# EAGLE schematic LE1-1 (EAGLE 8.5.1)
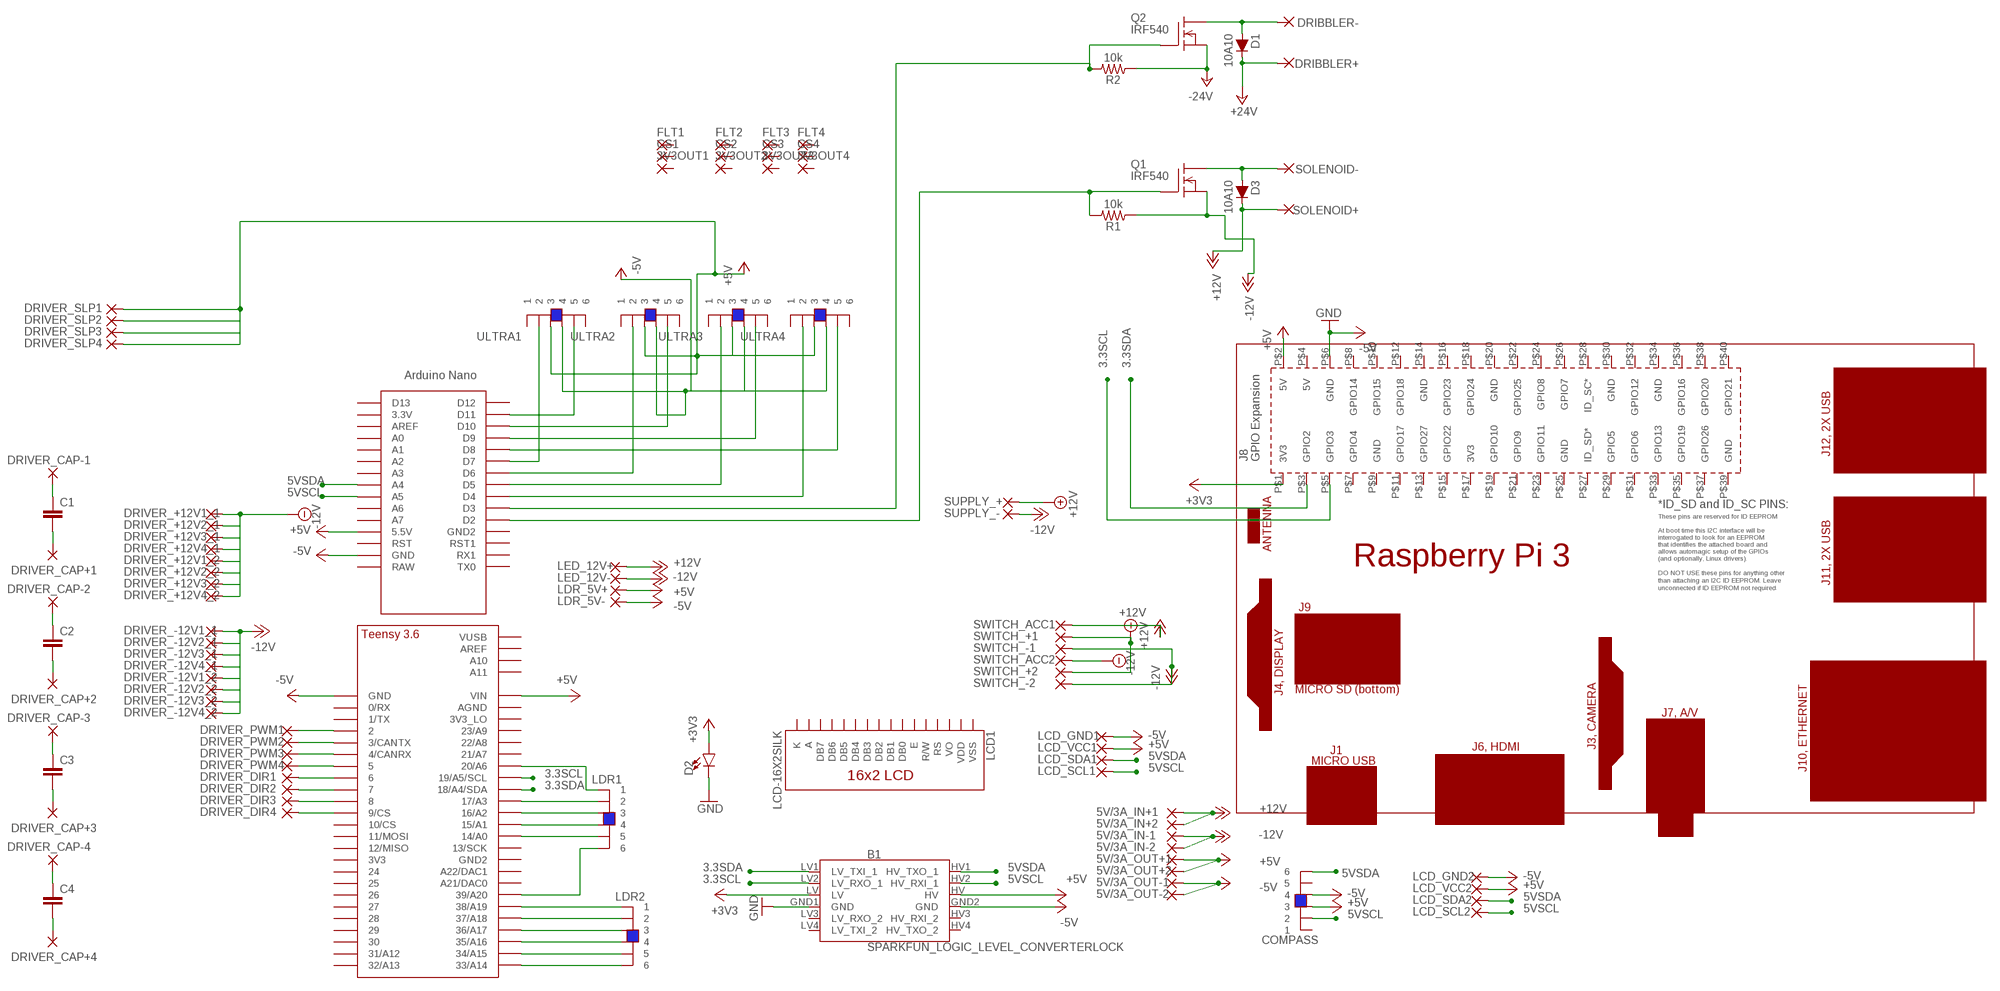
[diagram p0: schematic, sheet 1]

## Parts
3V3OUT1  2,54/1,0  [2,54/1,0]
3V3OUT2  2,54/1,0  [2,54/1,0]
3V3OUT3  2,54/1,0  [2,54/1,0]
3V3OUT4  2,54/1,0  [2,54/1,0]
5V/3A_IN+1  WIREPAD2,54/1,0  [2,54/1,0]
5V/3A_IN+2  WIREPAD2,54/1,0  [2,54/1,0]
5V/3A_IN-1  WIREPAD2,54/1,0  [2,54/1,0]
5V/3A_IN-2  WIREPAD2,54/1,0  [2,54/1,0]
5V/3A_OUT+1  WIREPAD2,54/1,0  [2,54/1,0]
5V/3A_OUT+2  WIREPAD2,54/1,0  [2,54/1,0]
5V/3A_OUT-1  WIREPAD2,54/1,0  [2,54/1,0]
5V/3A_OUT-2  WIREPAD2,54/1,0  [2,54/1,0]
B1  SPARKFUN_LOGIC_LEVEL_CONVERTERLOCK  [SPARKFUN_LOGIC_LEVEL_CONVERTER_LOCK]
C1  C5/7.2  [C5B7.2]
C2  C5/7.2  [C5B7.2]
C3  C5/7.2  [C5B7.2]
C4  C5/7.2  [C5B7.2]
COMPASS  6P6C_FEMALESMD  [6P6C_FEMALE]
CS1  2,54/1,0  [2,54/1,0]
CS2  2,54/1,0  [2,54/1,0]
CS3  2,54/1,0  [2,54/1,0]
CS4  2,54/1,0  [2,54/1,0]
D1  10A10  DIODE-1N4148  [DIODE-1N4148]
D2  LED-3MM-NO_SILK  [LED_3MM-NS]
D3  10A10  DIODE-1N4148  [DIODE-1N4148]
DRIBBLER+  2,54/1,0  [2,54/1,0]
DRIBBLER-  2,54/1,0  [2,54/1,0]
DRIVER_+12V1_1  WIREPAD2,54/1,0  [2,54/1,0]
DRIVER_+12V1_2  WIREPAD2,54/1,0  [2,54/1,0]
DRIVER_+12V2_1  WIREPAD2,54/1,0  [2,54/1,0]
DRIVER_+12V2_2  WIREPAD2,54/1,0  [2,54/1,0]
DRIVER_+12V3_1  WIREPAD2,54/1,0  [2,54/1,0]
DRIVER_+12V3_2  WIREPAD2,54/1,0  [2,54/1,0]
DRIVER_+12V4_1  WIREPAD2,54/1,0  [2,54/1,0]
DRIVER_+12V4_2  WIREPAD2,54/1,0  [2,54/1,0]
DRIVER_-12V1_1  WIREPAD2,54/1,0  [2,54/1,0]
DRIVER_-12V1_2  WIREPAD2,54/1,0  [2,54/1,0]
DRIVER_-12V2_1  WIREPAD2,54/1,0  [2,54/1,0]
DRIVER_-12V2_2  WIREPAD2,54/1,0  [2,54/1,0]
DRIVER_-12V3_1  WIREPAD2,54/1,0  [2,54/1,0]
DRIVER_-12V3_2  WIREPAD2,54/1,0  [2,54/1,0]
DRIVER_-12V4_1  WIREPAD2,54/1,0  [2,54/1,0]
DRIVER_-12V4_2  WIREPAD2,54/1,0  [2,54/1,0]
DRIVER_CAP+1  2,54/1,0  [2,54/1,0]
DRIVER_CAP+2  2,54/1,0  [2,54/1,0]
DRIVER_CAP+3  2,54/1,0  [2,54/1,0]
DRIVER_CAP+4  2,54/1,0  [2,54/1,0]
DRIVER_CAP-1  2,54/1,0  [2,54/1,0]
DRIVER_CAP-2  2,54/1,0  [2,54/1,0]
DRIVER_CAP-3  2,54/1,0  [2,54/1,0]
DRIVER_CAP-4  2,54/1,0  [2,54/1,0]
DRIVER_DIR1  WIREPAD2,54/1,0  [2,54/1,0]
DRIVER_DIR2  WIREPAD2,54/1,0  [2,54/1,0]
DRIVER_DIR3  WIREPAD2,54/1,0  [2,54/1,0]
DRIVER_DIR4  WIREPAD2,54/1,0  [2,54/1,0]
DRIVER_PWM1  WIREPAD2,54/1,0  [2,54/1,0]
DRIVER_PWM2  WIREPAD2,54/1,0  [2,54/1,0]
DRIVER_PWM3  WIREPAD2,54/1,0  [2,54/1,0]
DRIVER_PWM4  WIREPAD2,54/1,0  [2,54/1,0]
DRIVER_SLP1  WIREPAD2,54/1,0  [2,54/1,0]
DRIVER_SLP2  WIREPAD2,54/1,0  [2,54/1,0]
DRIVER_SLP3  WIREPAD2,54/1,0  [2,54/1,0]
DRIVER_SLP4  WIREPAD2,54/1,0  [2,54/1,0]
FLT1  2,54/1,0  [2,54/1,0]
FLT2  2,54/1,0  [2,54/1,0]
FLT3  2,54/1,0  [2,54/1,0]
FLT4  2,54/1,0  [2,54/1,0]
LCD1  LCD-16X2SILK  [LCD-16X2]
LCD_GND1  WIREPAD2,54/1,0  [2,54/1,0]
LCD_GND2  WIREPAD2,54/1,0  [2,54/1,0]
LCD_SCL1  WIREPAD2,54/1,0  [2,54/1,0]
LCD_SCL2  WIREPAD2,54/1,0  [2,54/1,0]
LCD_SDA1  WIREPAD2,54/1,0  [2,54/1,0]
LCD_SDA2  WIREPAD2,54/1,0  [2,54/1,0]
LCD_VCC1  WIREPAD2,54/1,0  [2,54/1,0]
LCD_VCC2  WIREPAD2,54/1,0  [2,54/1,0]
LDR1  6P6C_FEMALESMD  [6P6C_FEMALE]
LDR2  6P6C_FEMALESMD  [6P6C_FEMALE]
LDR_5V+  2,54/1,0  [2,54/1,0]
LDR_5V-  2,54/1,0  [2,54/1,0]
LED_12V+  2,54/1,0  [2,54/1,0]
LED_12V-  2,54/1,0  [2,54/1,0]
PCB1  RPI3  [RPI3]
Q1  IRF540  [TO220]
Q2  IRF540  [TO220]
R1  10k  10KOHM-HORIZ-1/4W-1%  [AXIAL-0.3]
R2  10k  10KOHM-HORIZ-1/4W-1%  [AXIAL-0.3]
SOLENOID+  2,54/1,0  [2,54/1,0]
SOLENOID-  2,54/1,0  [2,54/1,0]
SUPPLY_+  WIREPAD2,54/1,0  [2,54/1,0]
SUPPLY_-  WIREPAD2,54/1,0  [2,54/1,0]
SWITCH_+1  WIREPAD2,54/1,0  [2,54/1,0]
SWITCH_+2  WIREPAD2,54/1,0  [2,54/1,0]
SWITCH_-1  WIREPAD2,54/1,0  [2,54/1,0]
SWITCH_-2  WIREPAD2,54/1,0  [2,54/1,0]
SWITCH_ACC1  WIREPAD2,54/1,0  [2,54/1,0]
SWITCH_ACC2  WIREPAD2,54/1,0  [2,54/1,0]
U$1  TEENSY_3.5/3.6_BASIC  [TEENSY_3.5/3.6_BASIC]
U$2  NANO  [NANO]
ULTRA1  6P6C_FEMALESMD  [6P6C_FEMALE]
ULTRA2  6P6C_FEMALESMD  [6P6C_FEMALE]
ULTRA3  6P6C_FEMALESMD  [6P6C_FEMALE]
ULTRA4  6P6C_FEMALESMD  [6P6C_FEMALE]

## Nets
3.3SCL: B1.LV2(LV_RXO_1) PCB1.P$5(GPIO3) U$1.19/A5/SCL
3.3SDA: B1.LV1(LV_TXI_1) PCB1.P$3(GPIO2) U$1.18/A4/SDA
5VSCL: B1.HV2(HV_RXI_1) LCD_SCL1.1(P) LCD_SCL2.1(P) U$2.A5
5VSDA: B1.HV1(HV_TXO_1) LCD_SDA1.1(P) LCD_SDA2.1(P) U$2.A4
+3V3: B1.LV D2.A PCB1.P$1(3V3)
+5V: 5V/3A_OUT+1.1(P) 5V/3A_OUT+2.1(P) B1.HV COMPASS.3 DRIVER_SLP1.1(P) DRIVER_SLP2.1(P) DRIVER_SLP3.1(P) DRIVER_SLP4.1(P) LCD_VCC1.1(P) LCD_VCC2.1(P) LDR_5V+.1(P) PCB1.P$2(5V) U$1.VIN U$2.5V(5.5V) ULTRA1.3 ULTRA2.3 ULTRA3.3 ULTRA4.3
+12V: 5V/3A_IN+1.1(P) 5V/3A_IN+2.1(P) D3.C LED_12V+.1(P) SOLENOID+.1(P) SUPPLY_+.1(P) SWITCH_+1.1(P) SWITCH_+2.1(P) SWITCH_ACC1.1(P)
+24V: D1.C DRIBBLER+.1(P)
-5V: 5V/3A_OUT-1.1(P) 5V/3A_OUT-2.1(P) B1.GND2(GND) COMPASS.4 LCD_GND1.1(P) LCD_GND2.1(P) LDR_5V-.1(P) U$1.GND U$2.GND ULTRA1.4 ULTRA2.4 ULTRA3.4 ULTRA4.4
-12V: 5V/3A_IN-1.1(P) 5V/3A_IN-2.1(P) DRIVER_+12V1_1.1(P) DRIVER_+12V1_2.1(P) DRIVER_+12V2_1.1(P) DRIVER_+12V2_2.1(P) DRIVER_+12V3_1.1(P) DRIVER_+12V3_2.1(P) DRIVER_+12V4_1.1(P) DRIVER_+12V4_2.1(P) DRIVER_-12V1_1.1(P) DRIVER_-12V1_2.1(P) DRIVER_-12V2_1.1(P) DRIVER_-12V2_2.1(P) DRIVER_-12V3_1.1(P) DRIVER_-12V3_2.1(P) DRIVER_-12V4_1.1(P) DRIVER_-12V4_2.1(P) LED_12V-.1(P) Q1.3(S) R1.P$1 SUPPLY_-.1(P) SWITCH_-1.1(P) SWITCH_-2.1(P) SWITCH_ACC2.1(P)
-24V: Q2.3(S) R2.P$1
GND: B1.GND1(GND) D2.K(C) PCB1.P$6(GND) ; supply symbol labelled -5V
N$1: LDR1.6 U$1.39/A20
N$4: DRIVER_PWM1.1(P) U$1.2
N$5: DRIVER_PWM2.1(P) U$1.3/CANTX
N$6: LDR1.2 U$1.17/A3
N$7: LDR1.3 U$1.16/A2
N$8: LDR1.4 U$1.15/A1
N$9: LDR1.5 U$1.14/A0
N$10: LDR1.1 U$1.20/A6
N$11: DRIVER_PWM3.1(P) U$1.4/CANRX
N$12: D3.A Q1.2(D) SOLENOID-.1(P)
N$13: Q1.1(G) R1.P$2 U$2.D2
N$14: DRIVER_PWM4.1(P) U$1.5
N$15: Q2.1(G) R2.P$2 U$2.D3
N$16: D1.A DRIBBLER-.1(P) Q2.2(D)
N$17: DRIVER_DIR1.1(P) U$1.6
N$18: LDR2.1 U$1.38/A19
N$19: LDR2.2 U$1.37/A18
N$20: LDR2.3 U$1.36/A17
N$21: LDR2.4 U$1.35/A16
N$22: LDR2.5 U$1.34/A15
N$23: LDR2.6 U$1.33/A14
N$24: DRIVER_DIR2.1(P) U$1.7
N$25: DRIVER_DIR3.1(P) U$1.8
N$26: DRIVER_DIR4.1(P) U$1.9/CS
N$28: U$2.D11 ULTRA1.5
N$29: U$2.D10 ULTRA2.5
N$30: U$2.D9 ULTRA3.5
N$31: C1.1 DRIVER_CAP-1.1(P)
N$32: C1.2 DRIVER_CAP+1.1(P)
N$33: C2.1 DRIVER_CAP-2.1(P)
N$34: C2.2 DRIVER_CAP+2.1(P)
N$35: C3.1 DRIVER_CAP-3.1(P)
N$36: C3.2 DRIVER_CAP+3.1(P)
N$37: C4.1 DRIVER_CAP-4.1(P)
N$38: C4.2 DRIVER_CAP+4.1(P)
N$39: U$2.D8 ULTRA4.5
N$40: U$2.D7 ULTRA1.2
N$41: U$2.D6 ULTRA2.2
N$42: U$2.D5 ULTRA3.2
N$43: U$2.D4 ULTRA4.2
Unconnected: 3V3OUT1.1(P) 3V3OUT2.1(P) 3V3OUT3.1(P) 3V3OUT4.1(P) B1.HV3(HV_RXI_2) B1.HV4(HV_TXO_2) B1.LV3(LV_RXO_2) B1.LV4(LV_TXI_2) COMPASS.1 COMPASS.2 COMPASS.5 COMPASS.6 CS1.1(P) CS2.1(P) CS3.1(P) CS4.1(P) FLT1.1(P) FLT2.1(P) FLT3.1(P) FLT4.1(P) LCD1.3(VO) LCD1.4(RS) LCD1.5(R/W) LCD1.6(E) LCD1.7(DB0) LCD1.8(DB1) LCD1.9(DB2) LCD1.10(DB3) LCD1.11(DB4) LCD1.12(DB5) LCD1.13(DB6) LCD1.14(DB7) PCB1.P$4(5V) PCB1.P$7(GPIO4) PCB1.P$8(GPIO14) PCB1.P$9(GND) PCB1.P$10(GPIO15) PCB1.P$11(GPIO17) PCB1.P$12(GPIO18) PCB1.P$13(GPIO27) PCB1.P$14(GND) PCB1.P$15(GPIO22) PCB1.P$16(GPIO23) PCB1.P$17(3V3) PCB1.P$18(GPIO24) PCB1.P$19(GPIO10) PCB1.P$20(GND) PCB1.P$21(GPIO9) PCB1.P$22(GPIO25) PCB1.P$23(GPIO11) PCB1.P$24(GPIO8) PCB1.P$25(GND) PCB1.P$26(GPIO7) PCB1.P$27(ID_SD*) PCB1.P$28(ID_SC*) PCB1.P$29(GPIO5) PCB1.P$30(GND) PCB1.P$31(GPIO6) PCB1.P$32(GPIO12) PCB1.P$33(GPIO13) PCB1.P$34(GND) PCB1.P$35(GPIO19) PCB1.P$36(GPIO16) PCB1.P$37(GPIO26) PCB1.P$38(GPIO20) PCB1.P$39(GND) PCB1.P$40(GPIO21) U$1.0/RX U$1.1/TX U$1.3V3 U$1.3V3_LO U$1.10/CS U$1.11/MOSI U$1.12/MISO U$1.13/SCK U$1.21/A7 U$1.21/DAC0(A21/DAC0) U$1.22/A8 U$1.23/A9 U$1.24 U$1.25 U$1.26 U$1.27 U$1.28 U$1.29 U$1.30 U$1.31/A12 U$1.32/A13 U$1.A10 U$1.A11 U$1.A22/DAC1 U$1.AGND U$1.AREF U$1.GND2 U$1.VUSB U$2.3.3V U$2.A0 U$2.A1 U$2.A2 U$2.A3 U$2.A6 U$2.A7 U$2.AREF U$2.D12 U$2.D13 U$2.GND1(GND2) U$2.ICSP1 U$2.ICSP2 U$2.ICSP3 U$2.ICSP4 U$2.ICSP5 U$2.ICSP6 U$2.RAW U$2.RST U$2.RST1 U$2.RX1 U$2.TX0 ULTRA1.1 ULTRA1.6 ULTRA2.1 ULTRA2.6 ULTRA3.1 ULTRA3.6 ULTRA4.1 ULTRA4.6

## Power pins joined to a net without a drawn wire
A: LCD1.15(A)
K: LCD1.16(K)
VDD: LCD1.2(VDD)
VSS: LCD1.1(VSS)

## Library data of the parts
3V3OUT1-3V3OUT4 CS1-CS4 DRIBBLER+ DRIBBLER- DRIVER_CAP+1-DRIVER_CAP+4 DRIVER_CAP-1-DRIVER_CAP-4 FLT1-FLT4 LDR_5V+ LDR_5V- LED_12V+ LED_12V- SOLENOID+ SOLENOID- = wirepad:2,54/1,0: THROUGH-HOLE PAD
5V/3A_IN+1 5V/3A_IN+2 5V/3A_IN-1 5V/3A_IN-2 5V/3A_OUT+1 5V/3A_OUT+2 5V/3A_OUT-1 5V/3A_OUT-2 DRIVER_+12V1_1 DRIVER_+12V1_2 DRIVER_+12V2_1 DRIVER_+12V2_2 DRIVER_+12V3_1 DRIVER_+12V3_2 DRIVER_+12V4_1 DRIVER_+12V4_2 DRIVER_-12V1_1 DRIVER_-12V1_2 DRIVER_-12V2_1 DRIVER_-12V2_2 DRIVER_-12V3_1 DRIVER_-12V3_2 DRIVER_-12V4_1 DRIVER_-12V4_2 DRIVER_DIR1-DRIVER_DIR4 DRIVER_PWM1-DRIVER_PWM4 DRIVER_SLP1-DRIVER_SLP4 LCD_GND1 LCD_GND2 LCD_SCL1 LCD_SCL2 LCD_SDA1 LCD_SDA2 LCD_VCC1 LCD_VCC2 SUPPLY_+ SUPPLY_- SWITCH_+1 SWITCH_+2 SWITCH_-1 SWITCH_-2 SWITCH_ACC1 SWITCH_ACC2 = wirepad:WIREPAD: Wire PAD connect wire on PCB
B1 = SparkFun-Boards:SPARKFUN_LOGIC_LEVEL_CONVERTER: SparkFun Logic Level Converter -Bi-Directional This is the mechnical outline for the 3.3V - 5V bi directional logic level converter. *Note, the "LOCK" Package has the header pins staggered by an offset of 5 mils (off center line), so that when you slide a row of standard 0.1" headers into the PTH pads, it will hold position vertically. See the follwing turorial for more information on this type of special footprints: Sneaky Footprints <https://www.sparkfun.com/tutorials/114> SparkFun Products: SparkFun Logic Level Converter - Bi-Directional <https://www.sparkfun.com/products/12009>
C1-C4 = capacitor-wima:C: CAPACITOR naming: grid - package width
COMPASS LDR1 LDR2 ULTRA1-ULTRA4 = Yijiano:6P6C_FEMALE
D1 D3 = SparkFun-DiscreteSemi:DIODE: Diode These are standard reverse protection diodes and small signal diodes. SparkFun Products: SparkFun SparkPunk Sound Kit <https://www.sparkfun.com/products/11177> SparkFun ESP8266 Thing <https://www.sparkfun.com/products/13231>; PROD_ID: DIO-08378; VALUE: 200mA/100V/1V
D2 = SparkFun-LED:LED: LED (Generic) Standard schematic elements and footprints for 5mm, 3mm, 1206, and 0603 sized LEDs. Generic LEDs with no color specified.
LCD1 = SparkFun-Displays:LCD-16X2: Standard text-only 16x2 parallel input LCD Basic 16 character by 2 line display. Typically utilizes the extremely common HD44780 parallel interface chipset SparkFun Products: Basic 16x2 Green <https://www.sparkfun.com/products/255> Basic 8x2 Green <https://www.sparkfun.com/products/11122>; SF_ID: LCD-00255
PCB1 = e14_Rpi3_RevA:RPI3: Device for Raspberry Pi 3 board created by Dave Young for www.element14.com More information and support community is available at https://www.element14.com/community/community/raspberry-pi
Q1 Q2 = transistor-fet:IRF540: N-Channel Enhancement MOSFET (HEXFET); 100V; 28A; 0,077Ohm
R1 R2 = SparkFun-Resistors:10KOHM: 10kΩ resistor A resistor is a passive two-terminal electrical component that implements electrical resistance as a circuit element. Resistors act to reduce current flow, and, at the same time, act to lower voltage levels within circuits. - Wikipedia; PROD_ID: RES-12183
U$1 = Teensy356:TEENSY_3.5/3.6_BASIC
U$2 = Arduino-clone:NANO: Arduino Nano